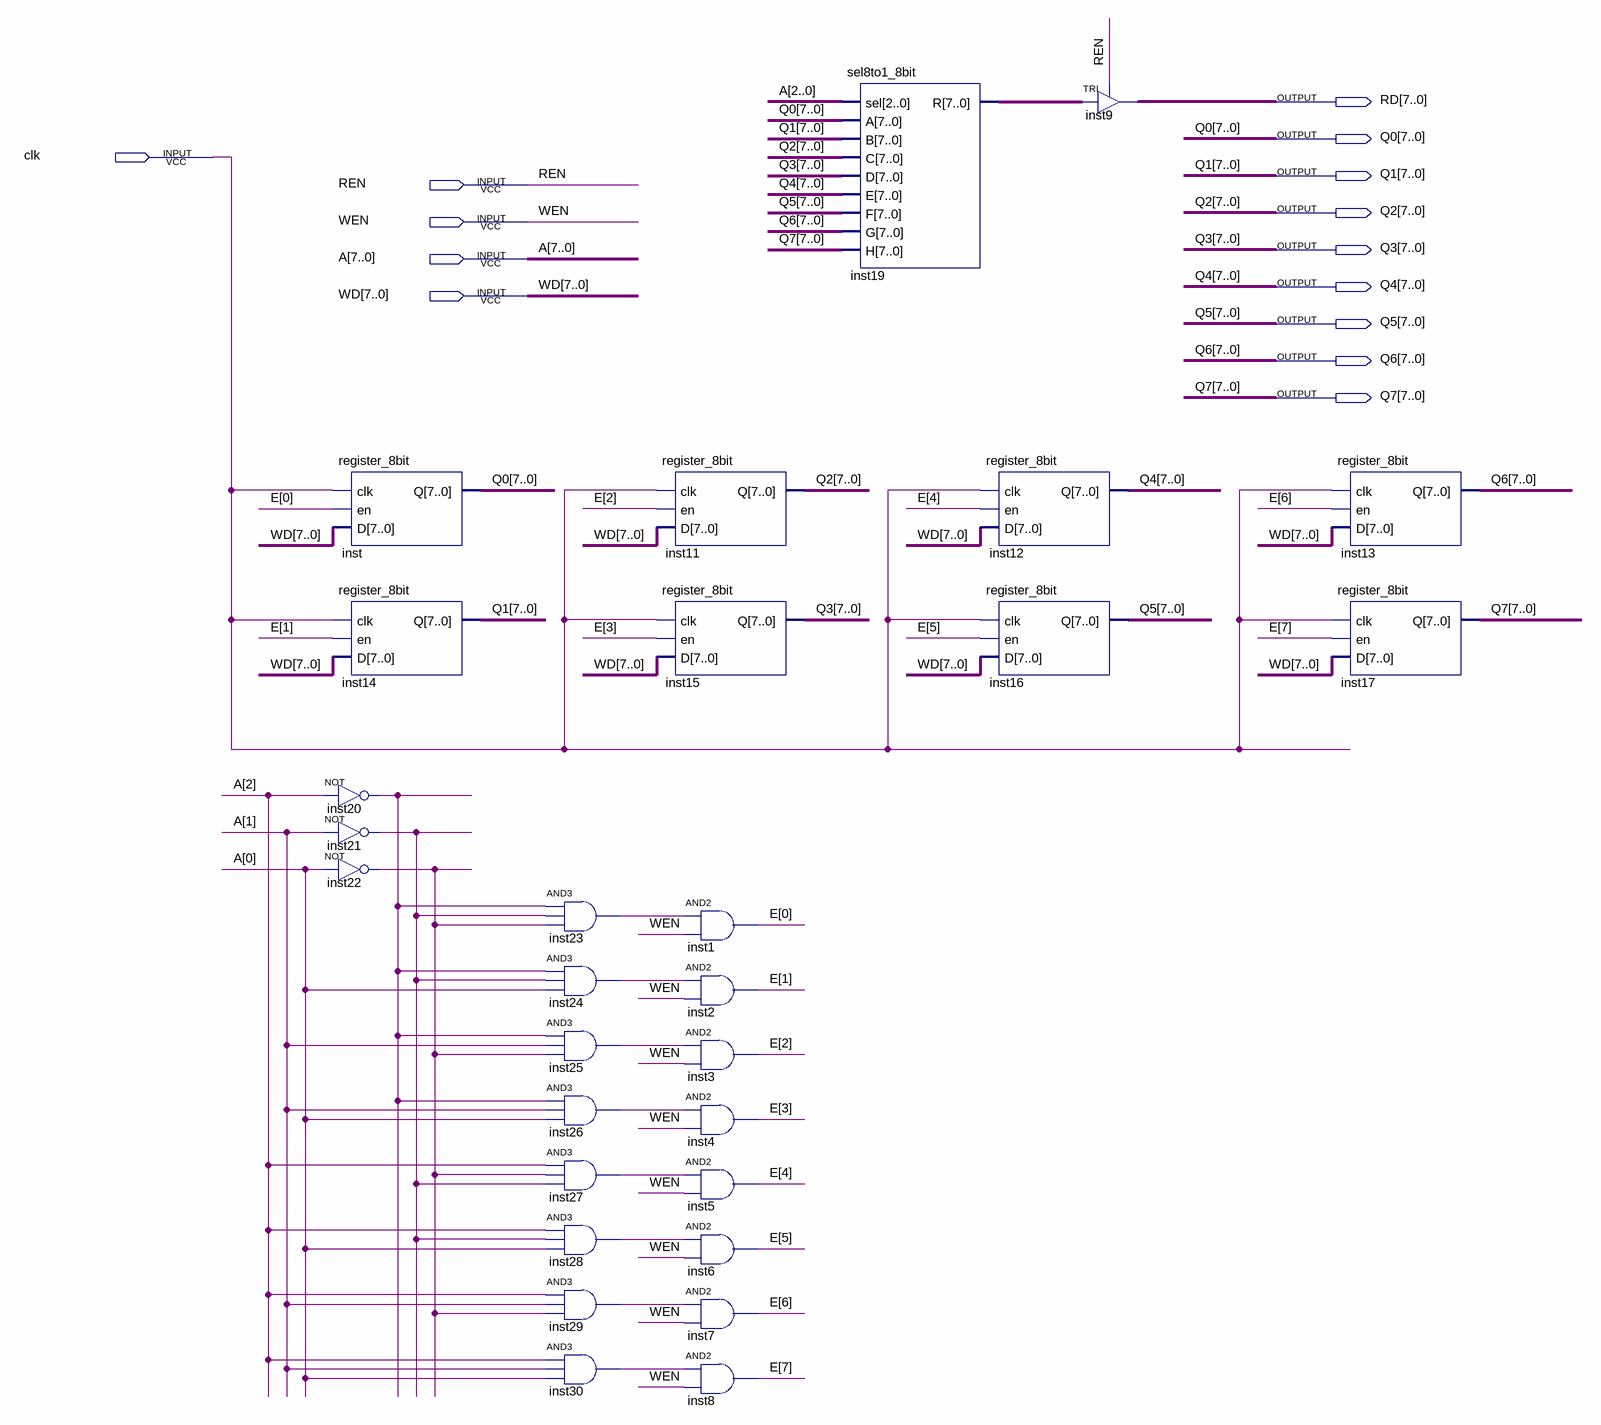
[diagram p0: schematic sheet]
// Quartus schematic Dmem.bdf as structural Verilog: 29 symbols, 14 pins
module Dmem (
  input  clk,
  input  REN,
  input  WEN,
  input  [7:0] A,
  input  [7:0] WD,
  output [7:0] RD,
  output [7:0] Q0,
  output [7:0] Q1,
  output [7:0] Q2,
  output [7:0] Q3,
  output [7:0] Q4,
  output [7:0] Q5,
  output [7:0] Q6,
  output [7:0] Q7
);

  wire inst20_out, inst21_out, inst22_out, inst23_out, inst24_out, inst25_out, inst26_out, inst27_out,
       inst28_out, inst29_out, inst30_out;
  wire [7:0] E, inst19_r;

  register_8bit inst (.clk(clk), .en(E[0]), .D(WD), .Q(Q0));
  register_8bit inst14 (.clk(clk), .en(E[1]), .D(WD), .Q(Q1));
  not inst20 (inst20_out, A[2]);
  not inst21 (inst21_out, A[1]);
  not inst22 (inst22_out, A[0]);
  and inst23 (inst23_out, inst20_out, inst21_out, inst22_out);
  and inst24 (inst24_out, inst20_out, inst21_out, A[0]);
  and inst25 (inst25_out, inst20_out, A[1], inst22_out);
  and inst26 (inst26_out, inst20_out, A[1], A[0]);
  and inst27 (inst27_out, A[2], inst22_out, inst21_out);
  and inst28 (inst28_out, A[2], inst21_out, A[0]);
  and inst29 (inst29_out, A[2], A[1], inst22_out);
  and inst30 (inst30_out, A[2], A[1], A[0]);
  register_8bit inst11 (.clk(clk), .en(E[2]), .D(WD), .Q(Q2));
  register_8bit inst15 (.clk(clk), .en(E[3]), .D(WD), .Q(Q3));
  and inst1 (E[0], inst23_out, WEN);
  and inst2 (E[1], inst24_out, WEN);
  and inst3 (E[2], inst25_out, WEN);
  and inst4 (E[3], inst26_out, WEN);
  and inst5 (E[4], inst27_out, WEN);
  and inst6 (E[5], inst28_out, WEN);
  and inst7 (E[6], inst29_out, WEN);
  and inst8 (E[7], inst30_out, WEN);
  sel8to1_8bit inst19 (.sel(A[2:0]), .A(Q0), .B(Q1), .C(Q2), .D(Q3), .E(Q4), .F(Q5), .G(Q6), .H(Q7), .R(inst19_r));
  register_8bit inst12 (.clk(clk), .en(E[4]), .D(WD), .Q(Q4));
  register_8bit inst16 (.clk(clk), .en(E[5]), .D(WD), .Q(Q5));
  TRI inst9[7:0] (.IN(inst19_r), .OE(REN), .OUT(RD));
  register_8bit inst13 (.clk(clk), .en(E[6]), .D(WD), .Q(Q6));
  register_8bit inst17 (.clk(clk), .en(E[7]), .D(WD), .Q(Q7));
endmodule
